# Altium schematic sheet LED.SchDoc
size A4; SheetNumber: 2; SheetTotal: 2
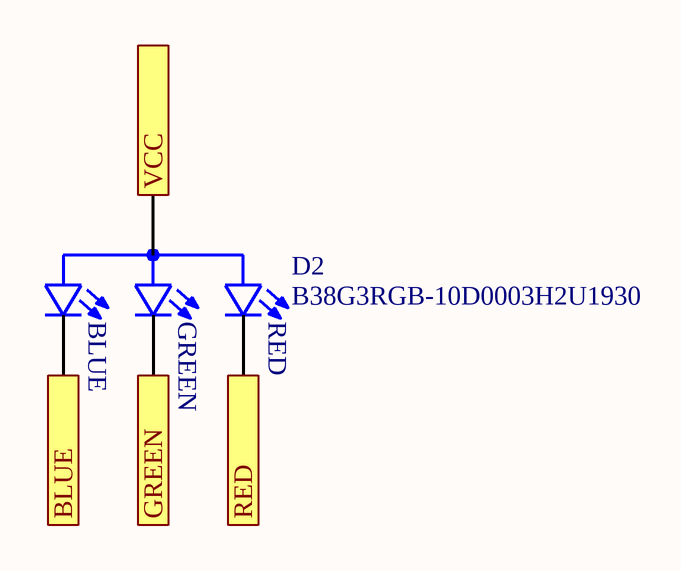
[diagram p0: LED.SchDoc]

## Parts
D2  B38G3RGB-10D0003H2U1930  [LED_B38G3RGB-10D0003H2U1930]

## Ports
BLUE (out), GREEN (out), RED (out), VCC (in)

## Nets
BLUE: D2.2(B_C) ; port BLUE
GREEN: D2.1(G_C) ; port GREEN
RED: D2.4(R_C) ; port RED
VCC: D2.3(A) ; port VCC

## Notes on the sheet
- (in symbol B38G3RGB-10D0003H2U1930) BLUE; GREEN; RED

## Library data of the parts
D2 = B38G3RGB-10D0003H2U1930: Red, Green, Blue (RGB) - LED Indication - Discrete 2V Red, 3V Green, 3V Blue 0606 (1616 Metric); MF: Harvatek Corporation; Price: None; Purchase-URL: https://pricing.snapeda.com/search/part/B38G3RGB-10D0003H2U1930/?ref=eda; SnapEDA_Link: https://www.snapeda.com/parts/B38G3RGB-10D0003H2U1930/Harvatek/view-part/?ref=snap; Availability: In Stock; Value: *; MP: B38G3RGB-10D0003H2U1930; Package: None; Check_prices: https://www.snapeda.com/parts/B38G3RGB-10D0003H2U1930/Harvatek/view-part/?ref=eda